# EAGLE schematic POVRotor (EAGLE 8.4.1)
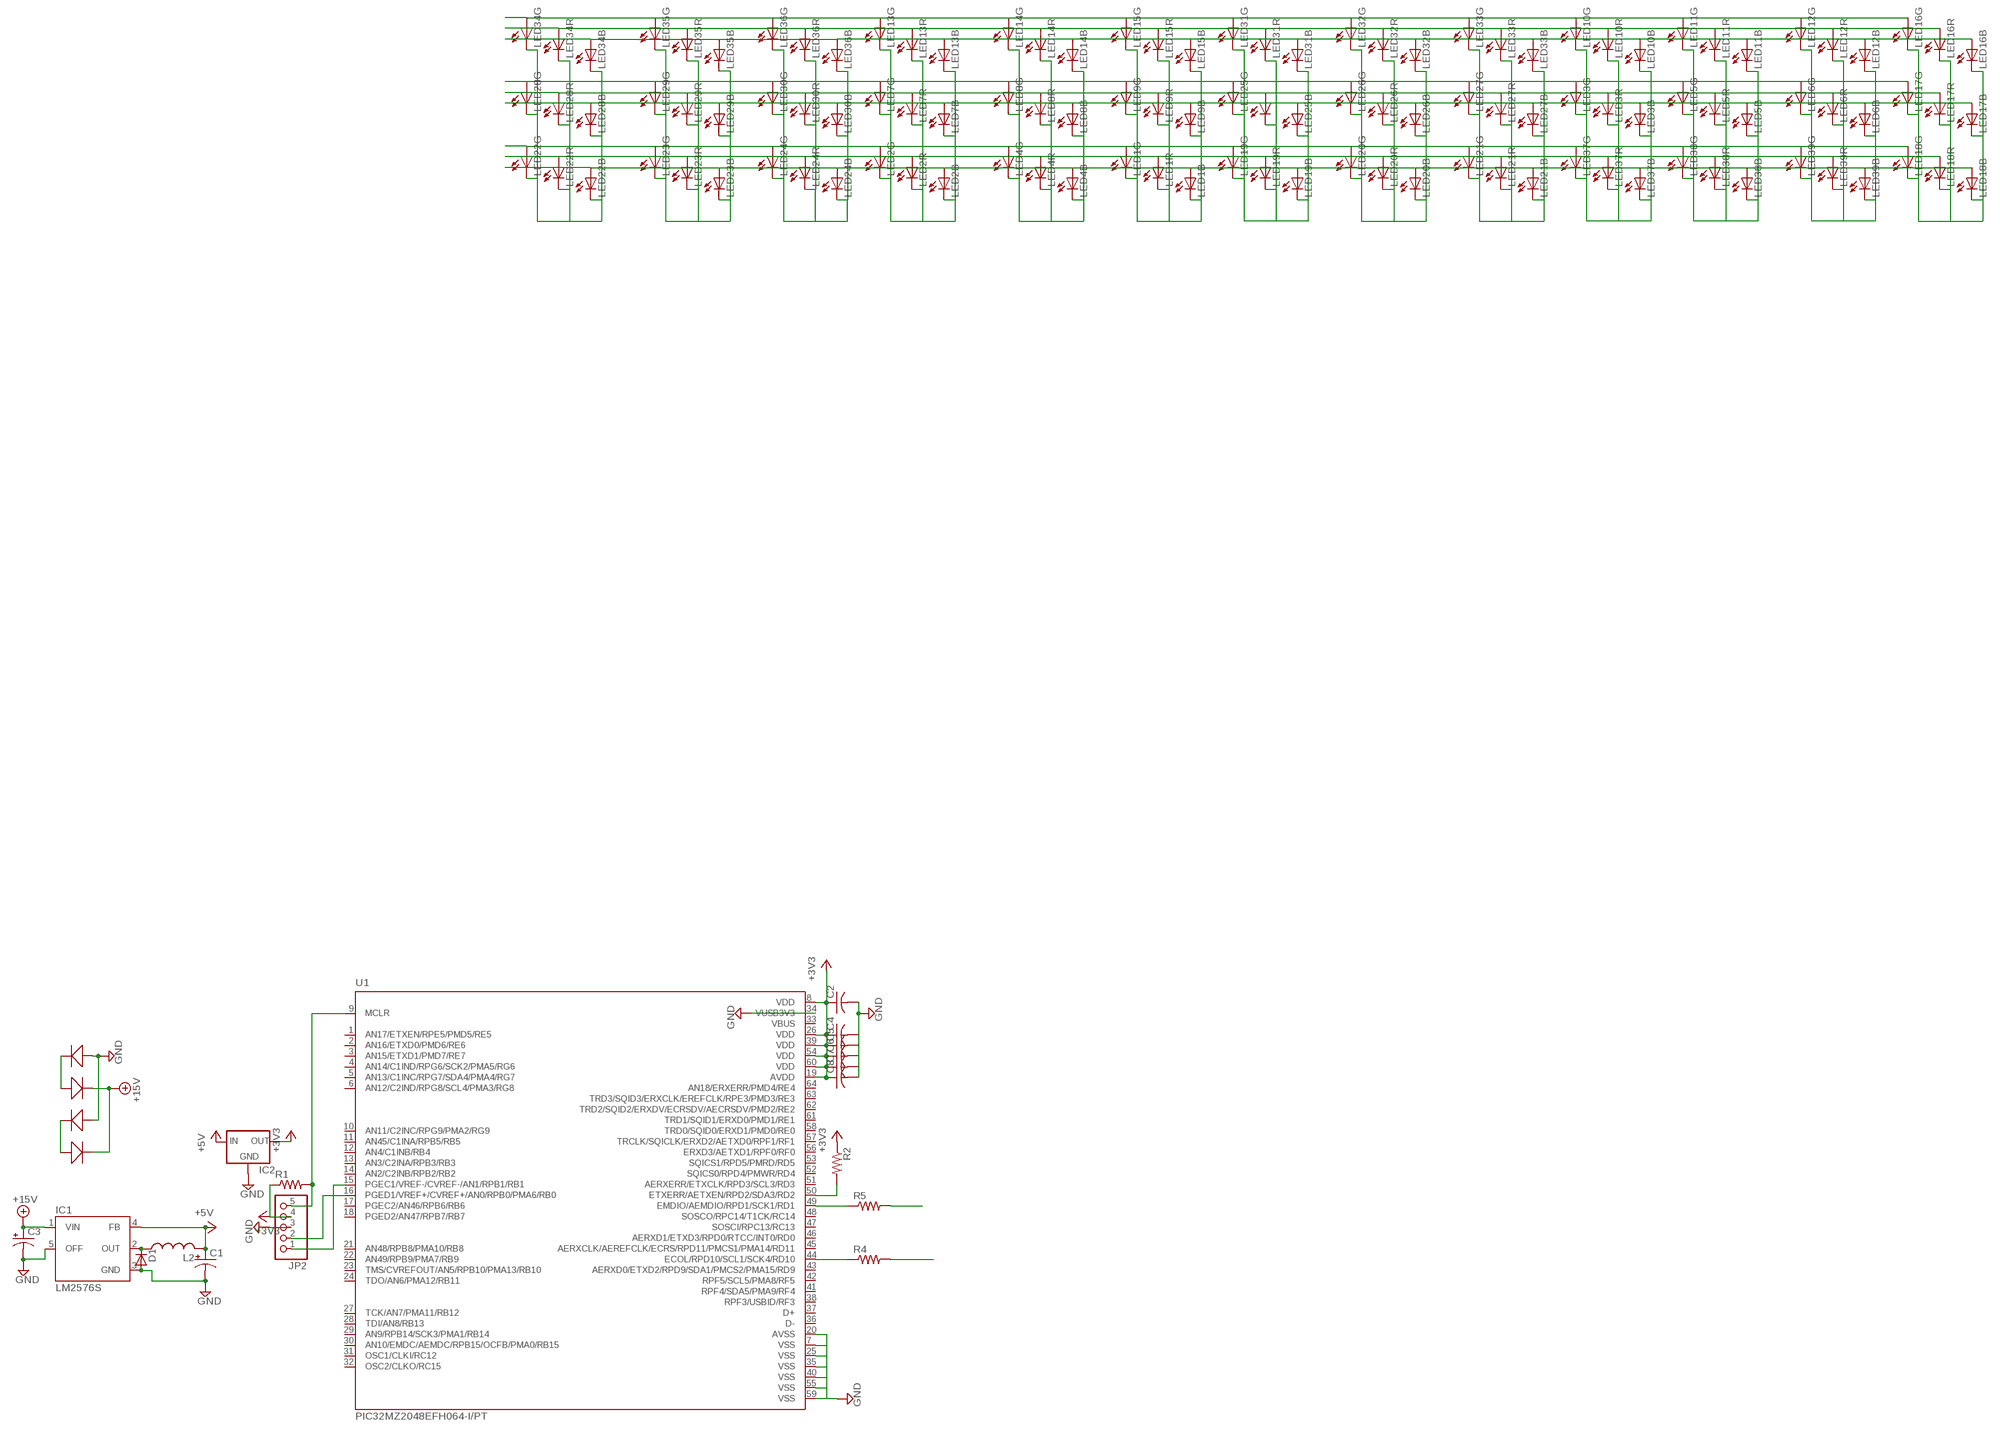
[diagram p0: schematic, sheet 1]

## Parts
C1  CPOL-USE2,5-6E  [E2,5-6E]
C2  C-USC0805  [C0805]
C3  CPOL-USE2,5-6E  [E2,5-6E]
C4  C-USC0805  [C0805]
C5  C-USC0805  [C0805]
C6  C-USC0805  [C0805]
C7  C-USC0805  [C0805]
C8  C-USC0805  [C0805]
D1  BYS10  [SOD106A]
D2  SMD-DIODE-SCHOTTKY-40V-3A(DO-214AB)  [DO-214AB]
D3  SMD-DIODE-SCHOTTKY-40V-3A(DO-214AB)  [DO-214AB]
D4  SMD-DIODE-SCHOTTKY-40V-3A(DO-214AB)  [DO-214AB]
D5  SMD-DIODE-SCHOTTKY-40V-3A(DO-214AB)  [DO-214AB]
IC1  LM2576S  [TO263-5]
IC2  LM1117  [SOT223]
JP2  PINHD-1X5  [1X05]
L2  L-USL4532P  [L4532P]
LED1  LP2C63-ST-RGB-SR0  [LP2C63-ST-RGB-SR0]
LED2  LP2C63-ST-RGB-SR0  [LP2C63-ST-RGB-SR0]
LED3  LP2C63-ST-RGB-SR0  [LP2C63-ST-RGB-SR0]
LED4  LP2C63-ST-RGB-SR0  [LP2C63-ST-RGB-SR0]
LED5  LP2C63-ST-RGB-SR0  [LP2C63-ST-RGB-SR0]
LED6  LP2C63-ST-RGB-SR0  [LP2C63-ST-RGB-SR0]
LED7  LP2C63-ST-RGB-SR0  [LP2C63-ST-RGB-SR0]
LED8  LP2C63-ST-RGB-SR0  [LP2C63-ST-RGB-SR0]
LED9  LP2C63-ST-RGB-SR0  [LP2C63-ST-RGB-SR0]
LED10  LP2C63-ST-RGB-SR0  [LP2C63-ST-RGB-SR0]
LED11  LP2C63-ST-RGB-SR0  [LP2C63-ST-RGB-SR0]
LED12  LP2C63-ST-RGB-SR0  [LP2C63-ST-RGB-SR0]
LED13  LP2C63-ST-RGB-SR0  [LP2C63-ST-RGB-SR0]
LED14  LP2C63-ST-RGB-SR0  [LP2C63-ST-RGB-SR0]
LED15  LP2C63-ST-RGB-SR0  [LP2C63-ST-RGB-SR0]
LED16  LP2C63-ST-RGB-SR0  [LP2C63-ST-RGB-SR0]
LED17  LP2C63-ST-RGB-SR0  [LP2C63-ST-RGB-SR0]
LED18  LP2C63-ST-RGB-SR0  [LP2C63-ST-RGB-SR0]
LED19  LP2C63-ST-RGB-SR0  [LP2C63-ST-RGB-SR0]
LED20  LP2C63-ST-RGB-SR0  [LP2C63-ST-RGB-SR0]
LED21  LP2C63-ST-RGB-SR0  [LP2C63-ST-RGB-SR0]
LED22  LP2C63-ST-RGB-SR0  [LP2C63-ST-RGB-SR0]
LED23  LP2C63-ST-RGB-SR0  [LP2C63-ST-RGB-SR0]
LED24  LP2C63-ST-RGB-SR0  [LP2C63-ST-RGB-SR0]
LED25  LP2C63-ST-RGB-SR0  [LP2C63-ST-RGB-SR0]
LED26  LP2C63-ST-RGB-SR0  [LP2C63-ST-RGB-SR0]
LED27  LP2C63-ST-RGB-SR0  [LP2C63-ST-RGB-SR0]
LED28  LP2C63-ST-RGB-SR0  [LP2C63-ST-RGB-SR0]
LED29  LP2C63-ST-RGB-SR0  [LP2C63-ST-RGB-SR0]
LED30  LP2C63-ST-RGB-SR0  [LP2C63-ST-RGB-SR0]
LED31  LP2C63-ST-RGB-SR0  [LP2C63-ST-RGB-SR0]
LED32  LP2C63-ST-RGB-SR0  [LP2C63-ST-RGB-SR0]
LED33  LP2C63-ST-RGB-SR0  [LP2C63-ST-RGB-SR0]
LED34  LP2C63-ST-RGB-SR0  [LP2C63-ST-RGB-SR0]
LED35  LP2C63-ST-RGB-SR0  [LP2C63-ST-RGB-SR0]
LED36  LP2C63-ST-RGB-SR0  [LP2C63-ST-RGB-SR0]
LED37  LP2C63-ST-RGB-SR0  [LP2C63-ST-RGB-SR0]
LED38  LP2C63-ST-RGB-SR0  [LP2C63-ST-RGB-SR0]
LED39  LP2C63-ST-RGB-SR0  [LP2C63-ST-RGB-SR0]
R1  R-US_R0805  [R0805]
R2  R-US_R0603  [R0603]
R4  R-US_R0603  [R0603]
R5  R-US_R0603  [R0603]
U1  PIC32MZ2048EFH064-I/PT  [QFP50P1200X1200X120-64N]

## Nets
+3V3: C2.1 C4.1 C5.1 C6.1 C7.1 C8.1 IC2.2(OUT) JP2.4 R1.1 R2.1 U1.8(VDD) U1.19(AVDD) U1.26(VDD) U1.39(VDD) U1.54(VDD) U1.60(VDD)
+5V: C1.+ IC1.4(FB) IC2.3(IN) L2.2
+15V: C3.+ D2.2(-) D3.2(-) IC1.1(VIN)
GND: C1.- C2.2 C3.- C4.2 C5.2 C6.2 C7.2 C8.2 D1.A D4.1(+) D5.1(+) IC1.3(GND) IC1.5(OFF) IC2.1(GND) JP2.3 U1.7(VSS) U1.20(AVSS) U1.25(VSS) U1.34(VUSB3V3) U1.35(VSS) U1.40(VSS) U1.55(VSS) U1.59(VSS)
N$1: D2.1(+) D5.2(-)
N$2: D3.1(+) D4.2(-)
N$3: D1.K IC1.2(OUT) L2.1
N$4: LED2.4(B:C) LED2.5(R:C) LED2.6(G:C) LED7.4(B:C) LED7.5(R:C) LED7.6(G:C) LED13.4(B:C) LED13.5(R:C) LED13.6(G:C)
N$5: R2.2 U1.50(ETXERR/AETXEN/RPD2/SDA3/RD2)
N$7: LED1.2(R:A) LED2.2(R:A) LED4.2(R:A) LED18.2(R:A) LED19.2(R:A) LED20.2(R:A) LED21.2(R:A) LED22.2(R:A) LED23.2(R:A) LED24.2(R:A) LED37.2(R:A) LED38.2(R:A) LED39.2(R:A)
N$8: LED4.4(B:C) LED4.5(R:C) LED4.6(G:C) LED8.4(B:C) LED8.5(R:C) LED8.6(G:C) LED14.4(B:C) LED14.5(R:C) LED14.6(G:C)
N$11: LED1.4(B:C) LED1.5(R:C) LED1.6(G:C) LED9.4(B:C) LED9.5(R:C) LED9.6(G:C) LED15.4(B:C) LED15.5(R:C) LED15.6(G:C)
N$12: JP2.2 U1.16(PGED1/VREF+/CVREF+/AN0/RPB0/PMA6/RB0)
N$13: JP2.1 U1.15(PGEC1/VREF-/CVREF-/AN1/RPB1/RB1)
N$14: JP2.5 R1.2 U1.9(MCLR)
N$16: R4.2
N$18: R5.2
N$19: R5.1 U1.49(EMDIO/AEMDIO/RPD1/SCK1/RD1)
N$21: R4.1 U1.44(ECOL/RPD10/SCL1/SCK4/RD10)
N$27: LED19.4(B:C) LED19.5(R:C) LED19.6(G:C) LED25.4(B:C) LED25.5(R:C) LED25.6(G:C) LED31.4(B:C) LED31.5(R:C) LED31.6(G:C)
N$28: LED20.4(B:C) LED20.5(R:C) LED20.6(G:C) LED26.4(B:C) LED26.5(R:C) LED32.4(B:C) LED32.5(R:C) LED32.6(G:C)
N$31: LED3.4(B:C) LED3.5(R:C) LED3.6(G:C) LED10.4(B:C) LED10.5(R:C) LED10.6(G:C) LED37.4(B:C) LED37.5(R:C) LED37.6(G:C)
N$38: LED5.4(B:C) LED5.5(R:C) LED5.6(G:C) LED11.4(B:C) LED11.5(R:C) LED11.6(G:C) LED38.4(B:C) LED38.5(R:C) LED38.6(G:C)
N$39: LED24.4(B:C) LED24.5(R:C) LED24.6(G:C) LED30.4(B:C) LED30.5(R:C) LED30.6(G:C) LED36.4(B:C) LED36.5(R:C) LED36.6(G:C)
N$44: LED23.4(B:C) LED23.5(R:C) LED23.6(G:C) LED29.4(B:C) LED29.5(R:C) LED29.6(G:C) LED35.4(B:C) LED35.5(R:C) LED35.6(G:C)
N$45: LED1.3(B:A) LED2.3(B:A) LED4.3(B:A) LED18.3(B:A) LED19.3(B:A) LED20.3(B:A) LED21.3(B:A) LED22.3(B:A) LED23.3(B:A) LED24.3(B:A) LED37.3(B:A) LED38.3(B:A) LED39.3(B:A)
N$47: LED1.1(G:A) LED2.1(G:A) LED4.1(G:A) LED18.1(G:A) LED19.1(G:A) LED20.1(G:A) LED21.1(G:A) LED22.1(G:A) LED23.1(G:A) LED24.1(G:A) LED37.1(G:A) LED38.1(G:A) LED39.1(G:A)
N$48: LED3.3(B:A) LED5.3(B:A) LED6.3(B:A) LED8.3(B:A) LED9.3(B:A) LED17.3(B:A) LED26.3(B:A) LED27.3(B:A) LED28.3(B:A) LED29.3(B:A) LED30.3(B:A)
N$49: LED3.2(R:A) LED5.2(R:A) LED6.2(R:A) LED7.2(R:A) LED8.2(R:A) LED9.2(R:A) LED17.2(R:A) LED25.2(R:A) LED26.2(R:A) LED27.2(R:A) LED28.2(R:A) LED29.2(R:A) LED30.2(R:A)
N$50: LED3.1(G:A) LED5.1(G:A) LED6.1(G:A) LED7.1(G:A) LED8.1(G:A) LED9.1(G:A) LED17.1(G:A) LED25.1(G:A) LED26.1(G:A) LED27.1(G:A) LED28.1(G:A) LED29.1(G:A) LED30.1(G:A)
N$51: LED10.1(G:A) LED11.1(G:A) LED12.1(G:A) LED13.1(G:A) LED14.1(G:A) LED15.1(G:A) LED16.1(G:A) LED31.1(G:A) LED32.1(G:A) LED33.1(G:A) LED34.1(G:A) LED35.1(G:A) LED36.1(G:A)
N$52: LED10.2(R:A) LED11.2(R:A) LED12.2(R:A) LED13.2(R:A) LED14.2(R:A) LED15.2(R:A) LED16.2(R:A) LED31.2(R:A) LED32.2(R:A) LED33.2(R:A) LED34.2(R:A) LED35.2(R:A) LED36.2(R:A)
N$53: LED10.3(B:A) LED11.3(B:A) LED12.3(B:A) LED13.3(B:A) LED14.3(B:A) LED15.3(B:A) LED16.3(B:A) LED31.3(B:A) LED32.3(B:A) LED33.3(B:A) LED34.3(B:A) LED35.3(B:A) LED36.3(B:A)
N$55: LED6.4(B:C) LED6.5(R:C) LED6.6(G:C) LED12.4(B:C) LED12.5(R:C) LED12.6(G:C) LED39.4(B:C) LED39.5(R:C) LED39.6(G:C)
N$56: LED16.4(B:C) LED16.5(R:C) LED16.6(G:C) LED17.4(B:C) LED17.5(R:C) LED17.6(G:C) LED18.4(B:C) LED18.5(R:C) LED18.6(G:C)
N$58: LED26.6(G:C)
N$61: LED21.4(B:C) LED21.5(R:C) LED21.6(G:C) LED27.4(B:C) LED27.5(R:C) LED27.6(G:C) LED33.4(B:C) LED33.5(R:C) LED33.6(G:C)
N$64: LED22.4(B:C) LED22.5(R:C) LED22.6(G:C) LED28.4(B:C) LED28.5(R:C) LED28.6(G:C) LED34.4(B:C) LED34.5(R:C) LED34.6(G:C)
Unconnected: LED1.TH(TH:TH) LED2.TH(TH:TH) LED3.TH(TH:TH) LED4.TH(TH:TH) LED5.TH(TH:TH) LED6.TH(TH:TH) LED7.3(B:A) LED7.TH(TH:TH) LED8.TH(TH:TH) LED9.TH(TH:TH) LED10.TH(TH:TH) LED11.TH(TH:TH) LED12.TH(TH:TH) LED13.TH(TH:TH) LED14.TH(TH:TH) LED15.TH(TH:TH) LED16.TH(TH:TH) LED17.TH(TH:TH) LED18.TH(TH:TH) LED19.TH(TH:TH) LED20.TH(TH:TH) LED21.TH(TH:TH) LED22.TH(TH:TH) LED23.TH(TH:TH) LED24.TH(TH:TH) LED25.3(B:A) LED25.TH(TH:TH) LED26.TH(TH:TH) LED27.TH(TH:TH) LED28.TH(TH:TH) LED29.TH(TH:TH) LED30.TH(TH:TH) LED31.TH(TH:TH) LED32.TH(TH:TH) LED33.TH(TH:TH) LED34.TH(TH:TH) LED35.TH(TH:TH) LED36.TH(TH:TH) LED37.TH(TH:TH) LED38.TH(TH:TH) LED39.TH(TH:TH) U1.1(AN17/ETXEN/RPE5/PMD5/RE5) U1.2(AN16/ETXD0/PMD6/RE6) U1.3(AN15/ETXD1/PMD7/RE7) U1.4(AN14/C1IND/RPG6/SCK2/PMA5/RG6) U1.5(AN13/C1INC/RPG7/SDA4/PMA4/RG7) U1.6(AN12/C2IND/RPG8/SCL4/PMA3/RG8) U1.10(AN11/C2INC/RPG9/PMA2/RG9) U1.11(AN45/C1INA/RPB5/RB5) U1.12(AN4/C1INB/RB4) U1.13(AN3/C2INA/RPB3/RB3) U1.14(AN2/C2INB/RPB2/RB2) U1.17(PGEC2/AN46/RPB6/RB6) U1.18(PGED2/AN47/RPB7/RB7) U1.21(AN48/RPB8/PMA10/RB8) U1.22(AN49/RPB9/PMA7/RB9) U1.23(TMS/CVREFOUT/AN5/RPB10/PMA13/RB10) U1.24(TDO/AN6/PMA12/RB11) U1.27(TCK/AN7/PMA11/RB12) U1.28(TDI/AN8/RB13) U1.29(AN9/RPB14/SCK3/PMA1/RB14) U1.30(AN10/EMDC/AEMDC/RPB15/OCFB/PMA0/RB15) U1.31(OSC1/CLKI/RC12) U1.32(OSC2/CLKO/RC15) U1.36(D-) U1.37(D+) U1.38(RPF3/USBID/RF3) U1.41(RPF4/SDA5/PMA9/RF4) U1.42(RPF5/SCL5/PMA8/RF5) U1.43(AERXD0/ETXD2/RPD9/SDA1/PMCS2/PMA15/RD9) U1.45(AERXCLK/AEREFCLK/ECRS/RPD11/PMCS1/PMA14/RD11) U1.46(AERXD1/ETXD3/RPD0/RTCC/INT0/RD0) U1.47(SOSCI/RPC13/RC13) U1.48(SOSCO/RPC14/T1CK/RC14) U1.51(AERXERR/ETXCLK/RPD3/SCL3/RD3) U1.52(SQICS0/RPD4/PMWR/RD4) U1.53(SQICS1/RPD5/PMRD/RD5) U1.56(ERXD3/AETXD1/RPF0/RF0) U1.57(TRCLK/SQICLK/ERXD2/AETXD0/RPF1/RF1) U1.58(TRD0/SQID0/ERXD1/PMD0/RE0) U1.61(TRD1/SQID1/ERXD0/PMD1/RE1) U1.62(TRD2/SQID2/ERXDV/ECRSDV/AECRSDV/PMD2/RE2) U1.63(TRD3/SQID3/ERXCLK/EREFCLK/RPE3/PMD3/RE3) U1.64(AN18/ERXERR/PMD4/RE4)

## Power pins joined to a net without a drawn wire
VBUS: U1.33(VBUS)

## Library data of the parts
C1 C3 = resistor:CPOL-US: POLARIZED CAPACITOR, American symbol
C2 C4-C8 = resistor:C-US: CAPACITOR, American symbol
D1 = telefunken:BYS10: DIODE; MPN: BYS10/45; OC_FARNELL: 9549188; OC_NEWARK: 96K7236
D2-D5 = SMD-DIODE-SCHOTTKY-40V-3A_DO-214AB_:SMD-DIODE-SCHOTTKY-40V-3A(DO-214AB): 304020018; AVAILABILITY: Good; DESCRIPTION: Rectifier%2C Schottky%3B DO-214AB%3B 3.0A IF%3B 0.75V%3B 40V%3B 100A IFRM%3B 10000V/us%3B 1000pF; MF: Vishay; MP: SS34-E3/57T; PACKAGE: DO-214 Vishay; PRICE: 0.24 USD
IC1 = lm2576:LM2576: National Semiconductor <http://www.national.com> 3.0A "Simple Switcher"(c) 52kHz, Vout 1.23-37V (HV: 57V), Vin 40V (HV: 60V), 50µA standby current
IC2 = lm2576:LM1117
JP2 = pinhead:PINHD-1X5: PIN HEADER
L2 = resistor:L-US: INDUCTOR, American symbol
LED1-LED39 = led:LP2C63-ST-RGB-SR0: 1.5W RGB HIGH POWER LED Source: http://www.ledtech.com.tw .. LP2C63-ST-RGB-SR0.SPEC.pdf
R1 R2 R4 R5 = resistor:R-US_: RESISTOR, American symbol
U1 = PIC32MZ2048EFH064-I_PT:PIC32MZ2048EFH064-I/PT: PIC32MZ Series 2 MB Flash 512 kB RAM 200 MHz 32-Bit Microcontroller - TQFP-64; AVAILABILITY: Good; DESCRIPTION: PIC32MZ Series 2 MB Flash 512 kB RAM 200 MHz 32-Bit Microcontroller - TQFP-64; MF: Microchip; MP: PIC32MZ2048EFH064-I/PT; PACKAGE: TQFP-64 Microchip; PRICE: 11.29 USD